# Altium schematic sheet FTDI.SchDoc
size A4; SheetNumber: 8; SheetTotal: 9
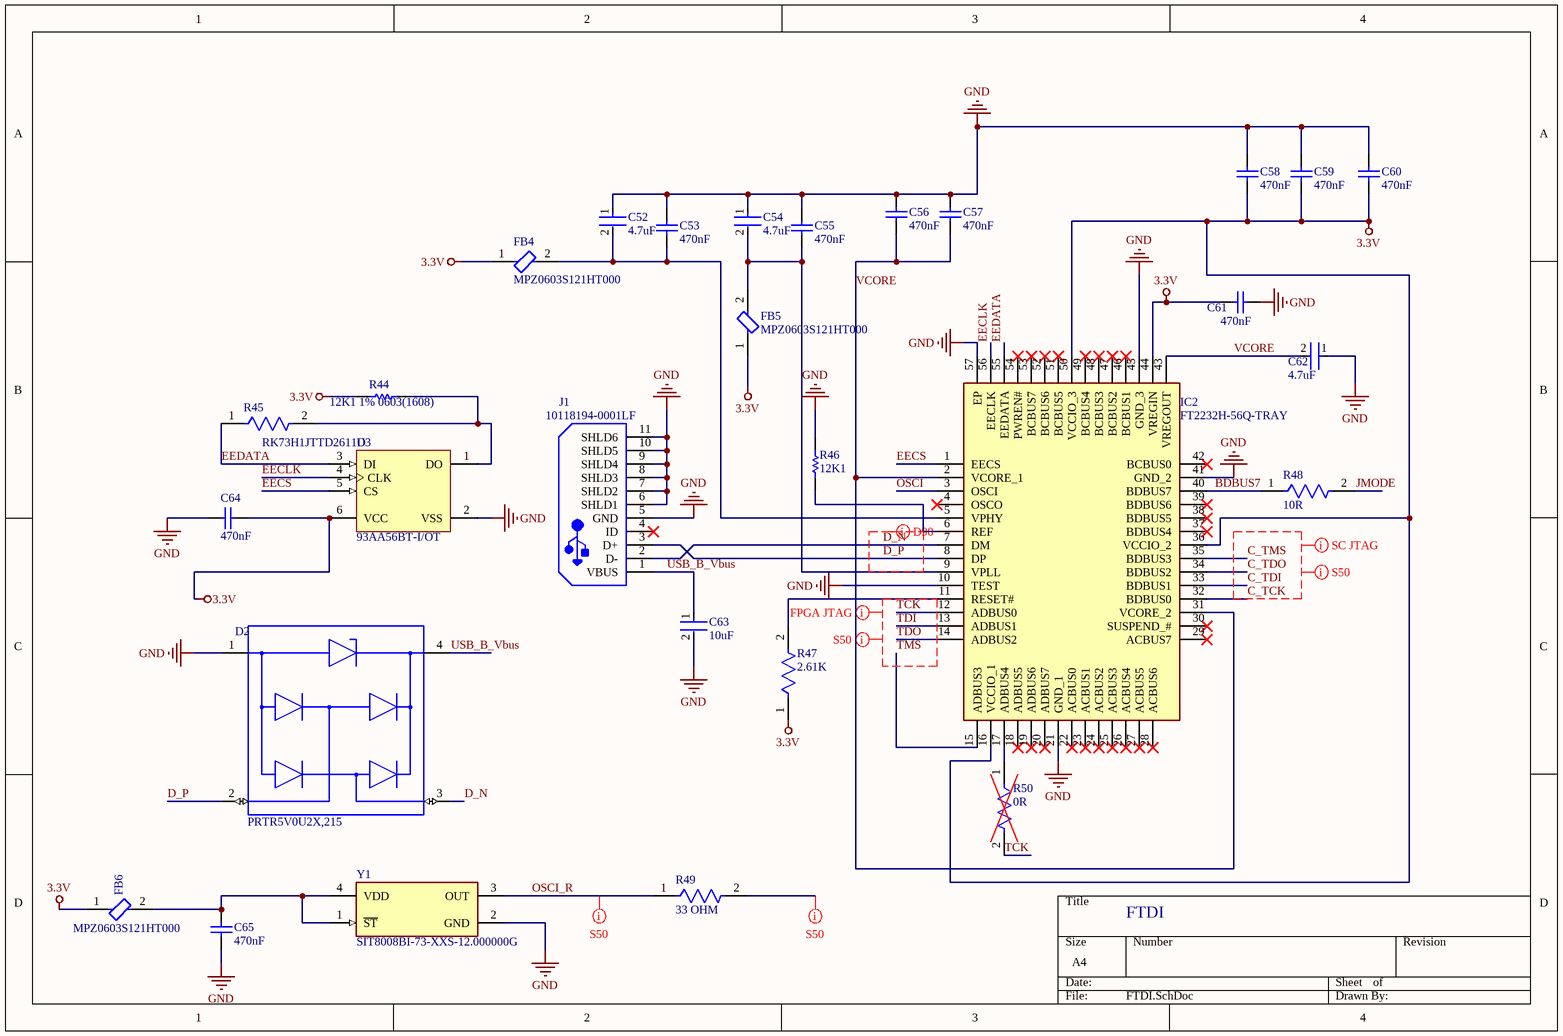
[diagram p0: FTDI.SchDoc]

## Parts
C52  4.7uF  [FP-GRM155-0_2-MFG]
C53  470nF  [CAPC2013X140X50ML20T25]
C54  4.7uF  [FP-GRM155-0_2-MFG]
C55  470nF  [CAPC2013X140X50ML20T25]
C56  470nF  [CAPC2013X140X50ML20T25]
C57  470nF  [CAPC2013X140X50ML20T25]
C58  470nF  [CAPC2013X140X50ML20T25]
C59  470nF  [CAPC2013X140X50ML20T25]
C60  470nF  [CAPC2013X140X50ML20T25]
C61  470nF  [CAPC2013X140X50ML20T25]
C62  4.7uF  [FP-GRM155-0_2-MFG]
C63  10uF  [FP-C0402C106M9PACTU-MFG]
C64  470nF  [CAPC2013X140X50ML20T25]
C65  470nF  [CAPC2013X140X50ML20T25]
D2  PRTR5V0U2X,215  [FP-SOT143B-MFG]
FB4  MPZ0603S121HT000  [FP-MPZ0603-IPC_C]
FB5  MPZ0603S121HT000  [FP-MPZ0603-IPC_C]
FB6  MPZ0603S121HT000  [FP-MPZ0603-IPC_C]
IC2  FT2232H-56Q-TRAY  [QFN50P800X800X100-57N-D]
J1  10118194-0001LF  [FCI-10118194-0001LF-5_V]
R44  12K1 1% 0603(1608)  [RESC0603(1608)_M]
R45  RK73H1JTTD2611D  [FP-RK73H1J-IPC_B]
R46  12K1  [RESC0603(1608)_M]
R47  2.61K  [FP-RK73H1J-IPC_B]
R48  10R  [FP-CR1206-IPC_B]
R49  33 OHM  [FP-CR0805-IPC_C]
R50  0R  [FP-HCJ0603-MFG]  (no BOM)
U3  93AA56BT-I/OT  [SOT-23-OT6_N]
Y1  SIT8008BI-73-XXS-12.000000G  [FP-SiT8008-7-MFG]

## Nets
3.3V: C58.2 C59.2 C60.2 C61.2 C64.1 FB4.1 FB5.1 FB6.1 IC2.16(VCCIO_1) IC2.36(VCCIO_2) IC2.44(VREGIN) IC2.50(VCCIO_3) R44.1 R47.1 U3.6(VCC)
GND: C52.1 C53.1 C54.1 C55.1 C56.1 C57.1 C58.1 C59.1 C60.1 C61.1 C62.1 C63.2 C64.2 C65.1 D2.1(GND) IC2.10(TEST) IC2.21(GND_1) IC2.41(GND_2) IC2.45(GND_3) IC2.57(EP) J1.5(GND) J1.6(SHLD1) J1.7(SHLD2) J1.8(SHLD3) J1.9(SHLD4) J1.10(SHLD5) J1.11(SHLD6) R46.2 U3.2(VSS) Y1.2(GND)
BDBUS7: IC2.40(BDBUS7) R48.1
C_TCK: IC2.32(BDBUS0)
C_TDI: IC2.33(BDBUS1)
C_TDO: IC2.34(BDBUS2)
C_TMS: IC2.35(BDBUS3)
D_N: D2.3(I/O_2) IC2.7(DM) J1.2(D-)
D_P: D2.2(I/O_1) IC2.8(DP) J1.3(D+)
EECLK: IC2.56(EECLK) U3.4(CLK)
EECS: IC2.1(EECS) U3.5(CS)
EEDATA: IC2.55(EEDATA) R45.1 U3.3(DI)
JMODE: R48.2
OSCI: IC2.3(OSCI)
OSCI_R: R49.1 Y1.3(OUT)
TCK: IC2.12(ADBUS0) R50.2
TDI: IC2.13(ADBUS1)
TDO: IC2.14(ADBUS2)
TMS: IC2.15(ADBUS3)
USB_B_Vbus: C63.1 D2.4(VCC) J1.1(VBUS)
VCORE: C56.2 C57.2 C62.2 IC2.2(VCORE_1) IC2.31(VCORE_2) IC2.43(VREGOUT)
NetC52_2: C52.2 C53.2 FB4.2 IC2.5(VPHY)
NetC54_2: C54.2 C55.2 FB5.2 IC2.9(VPLL)
NetC65_2: C65.2 FB6.2 Y1.1(~{ST}) Y1.4(VDD)
NetIC2_6: IC2.6(REF) R46.1
NetIC2_11: IC2.11(RESET#) R47.2
NetIC2_17: IC2.17(ADBUS4) R50.1
NetR44_2: R44.2 R45.2 U3.1(DO)

Not connected (* = marked no-connect by the designer): IC2 4(OSCO)* 18(ADBUS5)* 19(ADBUS6)* 20(ADBUS7)* 22(ACBUS0)* 23(ACBUS1)* 24(ACBUS2)* 25(ACBUS3)* 26(ACBUS4)* 27(ACBUS5)* 28(ACBUS6)* 29(ACBUS7)* 30(SUSPEND_#)* 37(BDBUS4)* 38(BDBUS5)* 39(BDBUS6)* 42(BCBUS0)* 46(BCBUS1)* 47(BCBUS2)* 48(BCBUS3)* 49(BCBUS4)* 51(BCBUS5)* 52(BCBUS6)* 53(BCBUS7)* 54(PWREN#)*; J1 4(ID)*; R49 2

## Layout directives
mark named S50: C_TCK, C_TDI, C_TDO, C_TMS, NetR49_2, OSCI_R, TCK, TDI, TDO, TMS
differential pair: D_N, D_P
mark named FPGA JTAG: TCK, TDI, TDO, TMS
mark named SC JTAG: C_TCK, C_TDI, C_TDO, C_TMS

## Notes on the sheet
- FTDI

## Library data of the parts
C52 C54 C62 = CMP-00260-57366380-1: GRM155D71A475ME15D Cap Ceramic Monolithic 4.7uF 10VDC 20% SMD Paper T/R; Capacitance: 4.7µF; Dielectric: X7T; Voltage Rating (DC): 10V; Length: 1mm; Thickness: 500µm; NexarPartId: 57366380; Width: 500µm; Case/Package: 0402; Lifecycle Status: Production
C53 C55-C61 C64 C65 = CMP-2007-04634-1: Manufacturer: AVX Interconnect / Elco; Part Number: 08055C474JAT2A
C63 = CMP-03020-034678-1: CAP CER 10UF 6.3V X5R 0402; Tolerance: 20%; Dielectric Material: Ceramic; Voltage Rating: 6.3V; Thickness: 0.028inch; REACH SVHC: No SVHC; RoHS Compliant: Yes; Case Code (Metric): 1005; Lead Free: Lead Free; Length: 0.039inch; Max Operating Temperature: 85°C; Capacitance: 10uF; Voltage Rating (DC): 6.3V; Min Operating Temperature: -55°C; Case/Package: 0402; Mount: Surface Mount; Case Code (Imperial): 0402; Dielectric: X5R; Packaging: Cut Tape; Width: 0.02inch
D2 = CMP-14436-000007-1: TVS DIODE 5.5V SOT143B
FB4-FB6 = CMP-08257-000447-1: CHIP BEADS FOR GENERAL SIGNAL LI; Max Current Rating: 1A; DC Resistance (DCR): 130mR; Number of Lines: 1; Min Operating Temperature: -55°C; Mount: Surface Mount; Case Code (Imperial): 0201; Case Code (Metric): 0603; Max Operating Temperature: 125°C; RoHS Compliant: Yes; Packaging: Cut Tape; Case/Package: 0201
IC2 = FT2232H-56Q-TRAY: Integrated Circuit; Manufacturer_Name: FTDI Chip; Datasheet Link: https://componentsearchengine.com/Datasheets/1/FT2232H-56Q-TRAY.pdf; Height: 1mm; Manufacturer_Part_Number: FT2232H-56Q-TRAY; Mouser Part Number: 895-FT2232H-56Q-TRAY; Mouser Price/Stock: https://www.mouser.co.uk/ProductDetail/FTDI/FT2232H-56Q-TRAY?qs=u4lROS522ZW4g0YyKZT0kg%3D%3D; Arrow Part Number: FT2232H-56Q-TRAY; Arrow Price/Stock: https://www.arrow.com/en/products/ft2232h-56q-tray/ftdi-chip?utm_currency=USD&region=europe
J1 = CMP-2000-05120-1: Micro USB B Type Receptacle, 1.8 A, -55 to 85 degC, 5-Pin SMD, RoHS, Tape and Reel; Manufacturer: Amphenol FCI; Body Orientation: RightAngle; Number of Contacts: 5; Pitch: 0.65mm; Gender: RCP; Rad Hard: No; Package Reference: 10118194-0001LF-5; Mounting: SurfaceMount; Manufacturer URL: http://www.fci.com/; Packaging: CutTape; Datasheet URL: https://datasheet.ciiva.com/26945/getdatasheetpartid-418619-26945695.pdf; Termination Method: Solder; Package Description: 5-Pin Surface Mount Device, Body 8.05 x 5.53 mm, Pitch 0.65 mm; Type: MicroUSBTypeB; Datasheet Version: Rev. A, 10/2011
R44 R46 = CMP-1012-00632-1: 12K1 0.1W 1% 0603 (1608 Metric)  SMD; Case-Metric: 1608; Case-EIA: 0603; Value: 12100.00 Ohm; Power: 0.1 W; Technology: SMT; Tolerance: 1 %
R45 R47 = CMP-04015-095862-1: 2.61kΩ ±0.5% 0.1W Chip Resistor 0603 Thick Film AEC-Q200 Qualified
R48 = CMP-07231-003129-1: Thick Film Chip Resistors 1206 10Ω 0.25W 5% 200ppm/°C; Power Rating: 250mW; Voltage Rating: 200V; Width: 0.063inch; Length: 0.126inch; Package Quantity: 10000; Mount: Surface Mount; Resistance: 10R; Packaging: Tape and Reel; Number of Terminations: 2; Termination: SMD/SMT; Max Operating Temperature: 155°C; Temperature Coefficient: 200ppm/°C; Max Power Dissipation: 250mW; Composition: Thick Film; Height: 0.03inch; Case Code (Imperial): 1206; Thickness: 610um; Features: Moisture Resistant; Case/Package: 1206; Contact Plating: Tin; Radiation Hardening: No; Min Operating Temperature: -55°C; Tolerance: 5%; Case Code (Metric): 3216
R49 = CMP-07231-004924-1: Thick Film Chip Resistors 0805 33Ω 0.125W 5% 200ppm/°C; Power Rating: 125mW; Resistance: 33R; Voltage Rating: 150V; Width: 1.25mm; Temperature Coefficient: 200ppm/°C; Case Code (Metric): 2012; Case Code (Imperial): 0805; Termination: SMD/SMT; Height: 0.5mm; Max Operating Temperature: 155°C; Case/Package: 0805; Thickness: 508um; Packaging: Tape and Reel; Min Operating Temperature: -55°C; Length: 2mm; Package Quantity: 10000; Tolerance: 5%
R50 = CMP-26527-000122-1: RES 0 OHM JUMPER 1/4W 0603; Resistance: 0mR; Termination: Wraparound; Mount: Surface Mount; Min Operating Temperature: -55°C; Number of Terminations: 2; Packaging: Tape and Reel; Case Code (Imperial): 0603; Height: 0.021inch; RoHS Compliant: Yes; Width: 0.031inch; Package Quantity: 5000; Max Operating Temperature: 155°C; Radiation Hardening: No; Case/Package: 0603; Length: 0.061inch; Case Code (Metric): 1608
U3 = CMP-0162-00347-1: 2K, 128x16-bit, 1.8V Microwire Serial EEPROM, 6-Pin SOT-23, Industrial Temperature, Tape and Reel; DatasheetVersion: revF, May-2008; PackageDescription: 6-Lead Plastic Small Outline Transistor (OT) [SOT-23]; PackageReference: SOT-23-OT6; Code_IPC: SOT26A-6; PackageVersion: revBB, Aug-2009
Y1 = CMP-25159-260607-1: MEMS OSC XO 12.0000MHZ H/LV-CMOS; RoHS Compliant: Yes; Series: SIT8008B